# EAGLE design Shruti-Main-v02 (EAGLE 5.06)
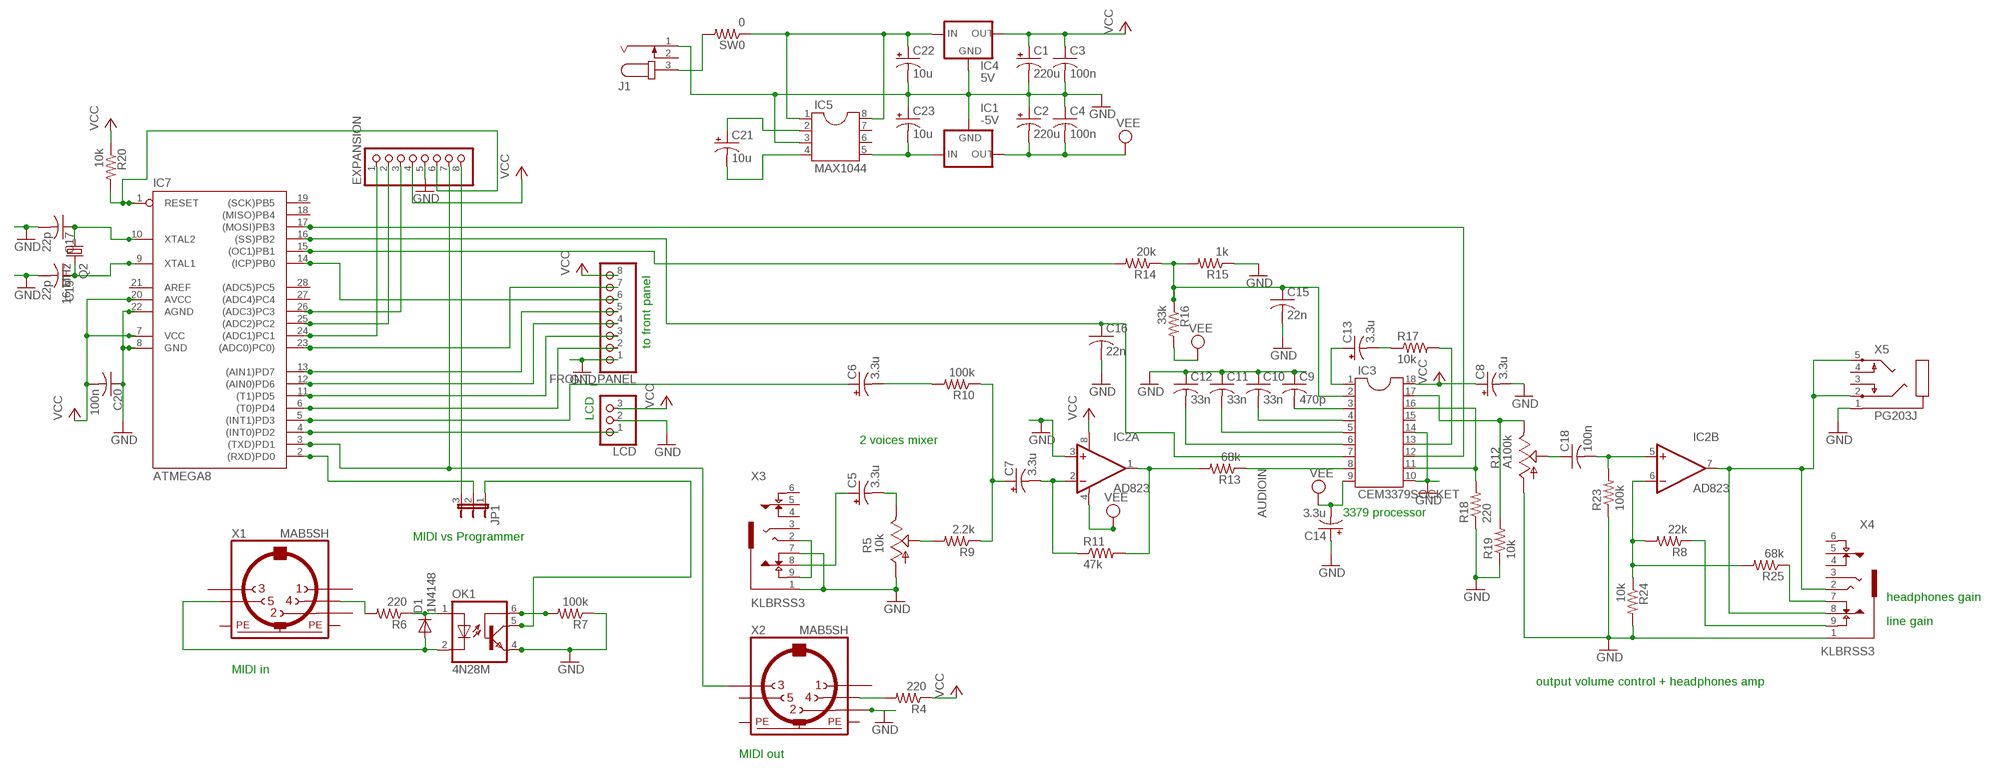
[diagram p0: schematic, sheet 1]

## Parts
C1  220u  CPOL-USE5-8.5  [E5-8,5]
C2  220u  CPOL-USE5-8.5  [E5-8,5]
C3  100n  C-US050-024X044  [C050-024X044]
C4  100n  C-US050-024X044  [C050-024X044]
C5  3.3u  CPOL-USE2.5-6  [E2,5-6]
C6  3.3u  CPOL-USE2.5-6  [E2,5-6]
C7  3.3u  CPOL-USE2.5-6  [E2,5-6]
C8  3.3u  CPOL-USE2.5-6  [E2,5-6]
C9  470p  C-US050-024X044  [C050-024X044]
C10  33n  C-US050-025X075  [C050-025X075]
C11  33n  C-US050-025X075  [C050-025X075]
C12  33n  C-US050-025X075  [C050-025X075]
C13  3.3u  CPOL-USE2.5-6  [E2,5-6]
C14  3.3u  CPOL-USE2.5-6  [E2,5-6]
C15  22n  C-US050-025X075  [C050-025X075]
C16  22n  C-US050-025X075  [C050-025X075]
C17  22p  C-US050-024X044  [C050-024X044]
C18  100n  C-US050-024X044  [C050-024X044]
C19  22p  C-US050-024X044  [C050-024X044]
C20  100n  C-US050-024X044  [C050-024X044]
C21  10u  CPOL-USE2.5-6  [E2,5-6]
C22  10u  CPOL-USE2.5-6  [E2,5-6]
C23  10u  CPOL-USE2.5-6  [E2,5-6]
D1  1N4148  1N4148DO35-7  [DO35-7]
EXPANSION  PINHD-1X8  [1X08]
FRONT_PANEL  PINHD-1X8  [1X08]
IC1  -5V  79XXL  [79XXL]
IC2  AD823  OPA2132P  [DIL08]
IC3  CEM3379SOCKET  [SOCKET18]
IC4  5V  78XXL  [78XXL]
IC5  MAX1044  DIL8  [DIL08]
IC7  ATMEGA8  AT90S4433P  [DIL28-3]
J1  JACK-PLUG1  [SPC4078]
JP1  JP2E  [JP2]
LCD  PINHD-1X3  [1X03]
OK1  4N28M  [DIL06]
Q2  16 MHz  CRYSTALHC49U-V  [HC49U-V]
R4  220  R-US_0204/7  [0204/7]
R5  10k  POT_USCABLED  [CABLE_POT_6MM]
R6  220  R-US_0204/7  [0204/7]
R7  100k  R-US_0204/7  [0204/7]
R8  22k  R-US_0204/7  [0204/7]
R9  2.2k  R-US_0204/7  [0204/7]
R10  100k  R-US_0204/7  [0204/7]
R11  47k  R-US_0204/7  [0204/7]
R12  A100k  POT_USCABLED  [CABLE_POT_6MM]
R13  68k  R-US_0204/7  [0204/7]
R14  20k  R-US_0204/7  [0204/7]
R15  1k  R-US_0204/7  [0204/7]
R16  33k  R-US_0204/7  [0204/7]
R17  10k  R-US_0204/7  [0204/7]
R18  220  R-US_0204/7  [0204/7]
R19  10k  R-US_0204/7  [0204/7]
R20  10k  R-US_0204/7  [0204/7]
R23  100k  R-US_0204/7  [0204/7]
R24  10k  R-US_0204/7  [0204/7]
R25  68k  R-US_0204/7  [0204/7]
SW0  0  R-US_0204/2V  [0204V]
X1  MAB5SH  [MAB5SH]
X2  MAB5SH  [MAB5SH]
X3  KLBRSS3  [KLBRSS3]
X4  KLBRSS3  [KLBRSS3]
X5  PG203J  [PG203J]

## Nets
AUDIOIN: IC2.1(A:OUT) R11.2 R13.2
GND: C1.- C2.+ C3.2 C4.1 C8.- C9.1 C10.1 C11.1 C12.1 C14.+ C15.2 C16.2 C17.2 C19.2 C20.1 C22.- C23.+ EXPANSION.5 FRONT_PANEL.1 IC1.GND IC2.3(A:+IN) IC3.10(GND) IC3.14(PANCV) IC4.GND IC5.3 IC7.8(GND) IC7.22(AGND) J1.1 LCD.2 OK1.4(EMI) R5.A R7.1 R12.A R15.1 R18.1 R19.1 R23.1 R24.2 X2.2 X3.1 X3.7 X4.1 X5.1
N$1: EXPANSION.8 JP1.3
N$2: C22.+ IC4.IN IC5.1 IC5.8 SW0.1
N$3: C21.+ IC5.2
N$4: FRONT_PANEL.2 IC7.6((T0)PD4)
N$5: IC3.8(VCFIN) R13.1
N$6: R4.2 X2.4
N$7: EXPANSION.2 IC7.25((ADC2)PC2)
N$8: FRONT_PANEL.7 IC7.23((ADC0)PC0))
N$9: FRONT_PANEL.4 IC7.12((AIN0)PD6)
N$10: FRONT_PANEL.5 IC7.13((AIN1)PD7)
N$11: IC7.4((INT0)PD2) LCD.1
N$12: C6.- R10.2
N$13: EXPANSION.7 IC7.3((TXD)PD1) X2.3
N$14: D1.C OK1.1(A) R6.1
N$15: C17.1 IC7.10(XTAL2) Q2.1
N$16: D1.A OK1.2(C) X1.5
N$17: R6.2 X1.4
N$18: JP1.1 OK1.5(COL)
N$19: R5.S R9.2
N$20: C6.+ IC7.5((INT1)PD3)
N$21: C7.- IC2.2(A:-IN) R11.1
N$22: FRONT_PANEL.3 IC7.11((T1)PD5)
N$23: C7.+ R9.1 R10.1
N$24: IC2.7(B:OUT) X4.2 X4.8 X5.2 X5.5
N$25: C18.2 IC2.5(B:+IN) R23.2
N$26: C9.2 IC3.3(CD)
N$27: C10.2 IC3.4(CC)
N$28: C5.- R5.E
N$29: C11.2 IC3.5(CB)
N$30: IC3.17(CHB) R12.E R19.2
N$31: C12.2 IC3.6(CA)
N$32: IC7.15((OC1)PB1) R14.2
N$33: C16.1 IC3.7(RESONANCECV) IC7.16((SS)PB2)
N$34: IC3.12(GAINCV) IC7.17((MOSI)PB3)
N$35: IC3.13(VCAIN) R17.2
N$36: C13.- R17.1
N$37: R25.1 X4.7
N$38: IC3.11(VCAOUT) IC3.16(PANIN) R18.2
N$39: C13.+ IC3.1(VCFOUT)
N$40: R8.1 X4.9
N$41: C5.+ X3.8
N$42: EXPANSION.6 IC7.1(RESET) R20.2
N$43: C15.1 IC3.2(FREQUENCYCV) R14.1 R15.2 R16.1
N$44: C18.1 R12.S
N$45: IC2.6(B:-IN) R8.2 R24.1 R25.2
N$46: X3.2 X3.9
N$47: J1.3 SW0.2
N$48: C19.1 IC7.9(XTAL1) Q2.2
N$49: EXPANSION.3 IC7.26((ADC3)PC3)
N$50: FRONT_PANEL.6 IC7.14((ICP)PB0)
N$51: OK1.6(BAS) R7.2
N$52: EXPANSION.1 IC7.24((ADC1)PC1)
N$53: IC7.2((RXD)PD0) JP1.2
N$55: C21.- IC5.4
N$56: C23.- IC1.IN IC5.5
VCC: C1.+ C3.1 C8.+ C20.2 EXPANSION.4 FRONT_PANEL.8 IC2.8(A:V+) IC3.18(VCC) IC4.OUT IC7.7(VCC) IC7.20(AVCC) LCD.3 R4.1 R20.1
VEE: C2.- C4.2 C14.- IC1.OUT IC2.4(A:V-) IC3.9(VEE) R16.2
Unconnected: IC3.15(CHAOUT) IC5.6 IC5.7 IC7.18((MISO)PB4) IC7.19((SCK)PB5) IC7.21(AREF) IC7.27((ADC4)PC4) IC7.28((ADC5)PC5) J1.2 X1.1 X1.2 X1.3 X2.1 X2.5 X3.3 X3.4 X3.5 X3.6 X4.3 X4.4 X4.5 X4.6 X5.3 X5.4

## Notes on the sheet
- to front panel
- LCD
- 2 voices mixer
- 3379 processor
- MIDI vs Programmer
- headphones gain
- line gain
- MIDI in
- output volume control + headphones amp
- MIDI out

## Power pins joined to a net without a drawn wire
PE: X1.PE X1.PE@(PE) X2.PE X2.PE@(PE)

## Library data of the parts
C1 C2 C5-C8 C13 C14 C21-C23 = rcl:CPOL-US: POLARIZED CAPACITOR, American symbol
C3 C4 C9-C12 C15-C20 = rcl:C-US: CAPACITOR, American symbol
D1 = diode:1N4148: DIODE high speed (Philips)
EXPANSION FRONT_PANEL = pinhead:PINHD-1X8: PIN HEADER
IC1 = v-reg:79XXL: VOLTAGE REGULATOR
IC2 = burr-brown:OPA2132: High Speed FET-Input Operational Amplifiers< Product Folder:OPA2132
IC3 = cem:CEM3379: Voltage Controlled Signal Processor VCF+VCA+panner
IC4 = v-reg:78XXL: VOLTAGE REGULATOR
IC5 = ic-package:DIL8: Dual In Line / Socket
IC7 = atmel:AT90S4433: MICROCONTROLLER 4 Kbytes FLASH 128 bytes SRAM 256 bytes EEPROM UART 6-channel 10 bit ADC
J1 = con-jack:JACK-PLUG: DC POWER JACK Power Jack, DC, Right Angle, Through Hole, Rated 5A at 16VDC, PC Terminals Distributor: Farnell (www.Farnell.de) Drawing: 84N1161.pdf / 84N1162.pdf Manufacturer: SPC Technology (www.spctechnology.com) Type: SPC4077 / SPC 4078
JP1 = jumper:JP2E: JUMPER
LCD = pinhead:PINHD-1X3: PIN HEADER
OK1 = optocoupler:4N*?M: General Purpose 6-Pin Phototransistor Optocouplers Source: http://www.fairchildsemi.com/ds/4N/4N35-M.pdf
Q2 = crystal:CRYSTAL: CRYSTAL
R4 R6-R11 R13-R20 R23-R25 SW0 = resistor:R-US_: RESISTOR, American symbol
R5 R12 = pot-cable:POT_US
X1 X2 = con-hirschmann:MAB5SH: Female CONNECTOR 5 pins 90 deg. with shield, horizontal (DIN 41524)
X3 X4 = con-lumberg:KLBRSS3: Jack connectors according to JISC 6560, 6.35 mm Klinkeneinbaukupplung nach JISC 6560, 6,35 mm, 3-polig/stereo, abgewinkelte Ausführung, mit 2 Umschaltern, Leiterplatten Rückseitenmontage Source: http://www.lumberg.de/Produkte/PDFs/KLBRSS3.pdf
X5 = con-hirschmann:PG203J: MIC/HEADPHONE JACK KS-S stereo microphone/headphone jack PG203JN (Schukat)

## Board
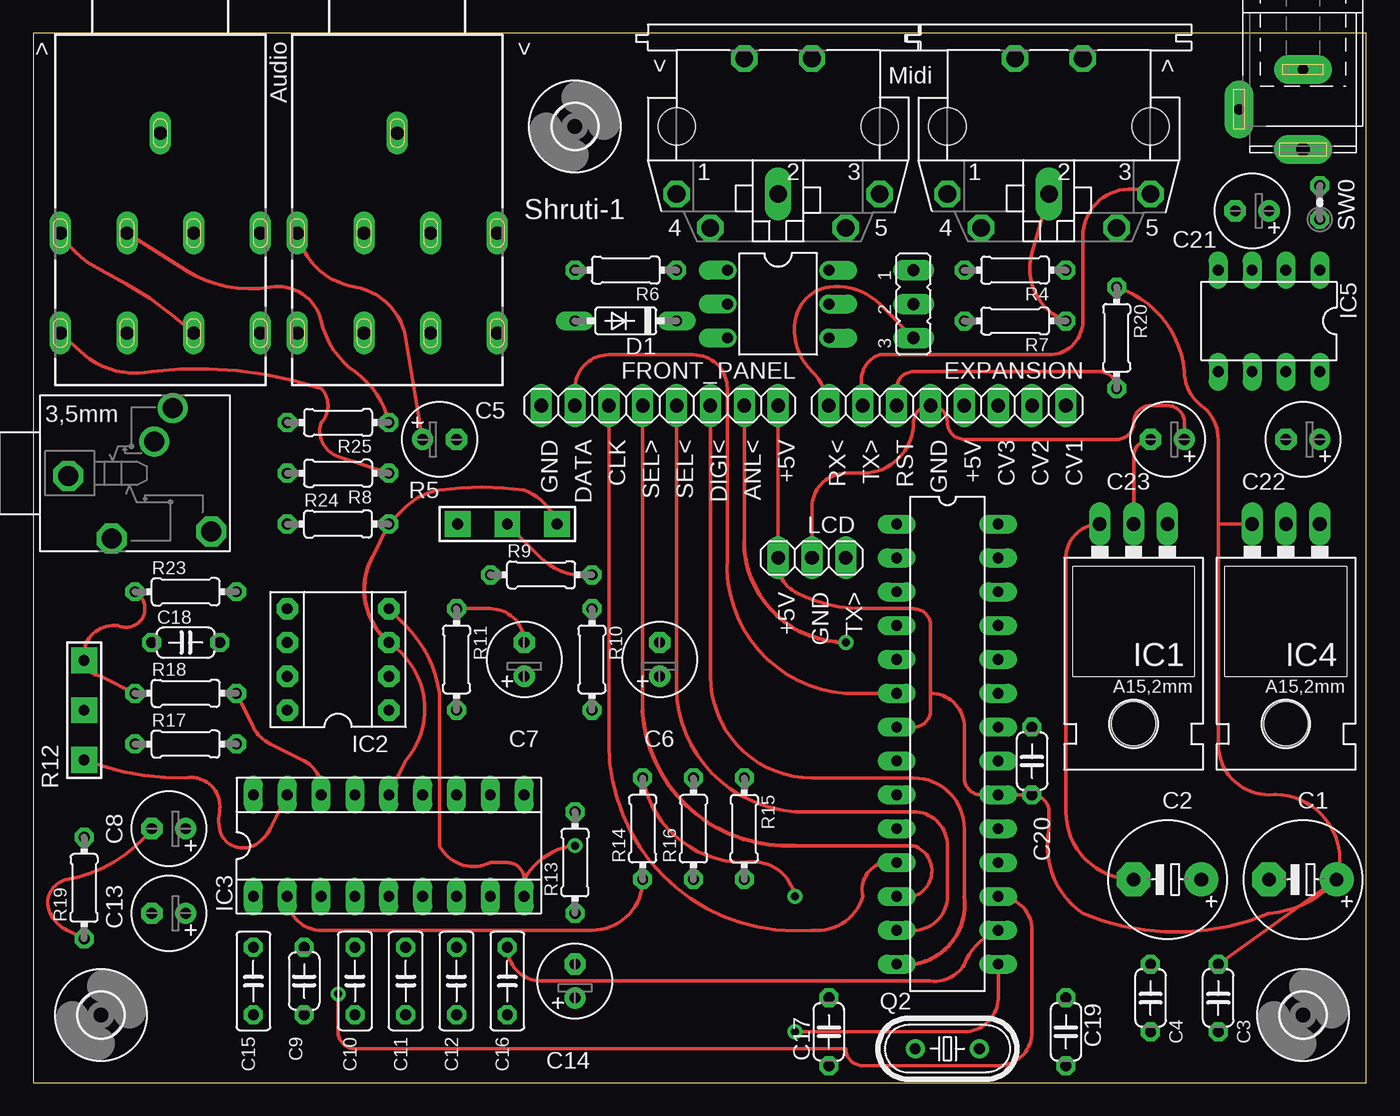
[diagram p1: board, top side]
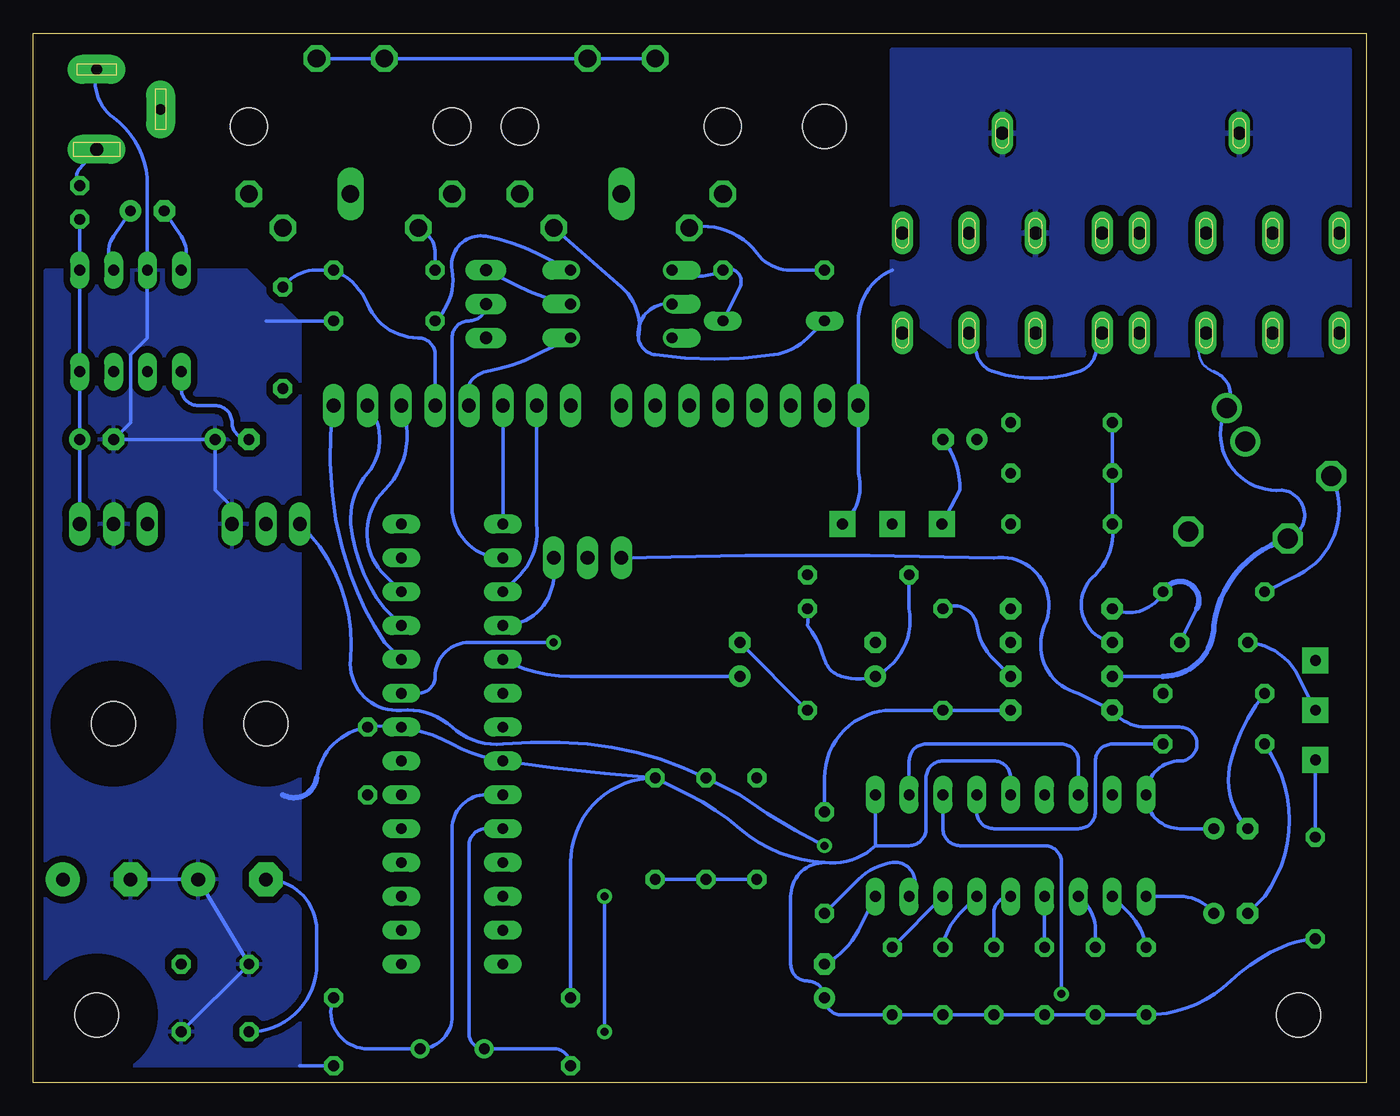
[diagram p2: board, bottom side, seen from below]

Size 100 x 78.73 mm. Coordinates in mm from the lower left corner, seen from the top.
Outline: 100,0 100,78.73 0,78.73 0,0 100,0
Copper layers (1*16): Top 0.035mm / dielectric 1.5mm / Bottom 0.035mm
Design rules "SparkFun": minimum track width 8mil, minimum drill 20mil, track to track 8mil, track to pad 8mil, pad to pad 8mil, via to via 8mil, smd to smd 8mil, copper to edge 10mil, drill to drill 8mil, minimum pad ring 12mil, minimum via ring 10mil, stop-mask expansion 4mil, vias tented up to drill 25mil, thermal gap 10mil

### Footprints (pad centres in the part's own frame; a part is rotated, then mirrored left to right if it is on the bottom)
E5-8,5 = drill 1.016 pad 2.54 round: + -2.54,0 | drill 1.016 pad 2.54 octagon: - 2.54,0
C050-024X044 = drill 0.813 octagon: 1 -2.54,0; 2 2.54,0
E2,5-6 = drill 0.813 pad 1.6 round: + -1.27,0 | drill 0.813 pad 1.6 octagon: - 1.27,0
C050-025X075 = drill 0.813 octagon: 1 -2.54,0; 2 2.54,0
DO35-7 = drill 0.813 long: A 3.81,0; C -3.81,0
1X08 = drill 1.016 long: 1 -8.89,0; 2 -6.35,0; 3 -3.81,0; 4 -1.27,0; 5 1.27,0; 6 3.81,0; 7 6.35,0; 8 8.89,0
79XXL = drill 1.016 long: GND -2.54,-3.81; IN 0,-3.81; OUT 2.54,-3.81 | hole 3.302: 0,11.176
DIL08 = drill 0.813 pad 1.6 octagon: 1 -3.81,-3.81; 2 -1.27,-3.81; 3 1.27,-3.81; 4 3.81,-3.81; 5 3.81,3.81; 6 1.27,3.81; 7 -1.27,3.81; 8 -3.81,3.81
SOCKET18 = drill 0.813 long: 1 -10.16,-3.81; 2 -7.62,-3.81; 3 -5.08,-3.81; 4 -2.54,-3.81; 5 0,-3.81; 6 2.54,-3.81; 7 5.08,-3.81; 8 7.62,-3.81; 9 10.16,-3.81; 10 10.16,3.81; 11 7.62,3.81; 12 5.08,3.81; 13 2.54,3.81; 14 0,3.81; 15 -2.54,3.81; 16 -5.08,3.81; 17 -7.62,3.81; 18 -10.16,3.81
78XXL = drill 1.016 long: GND 0,-3.81; IN -2.54,-3.81; OUT 2.54,-3.81 | hole 3.302: 0,11.176
DIL08' = drill 0.813 long: 1 -3.81,-3.81; 2 -1.27,-3.81; 3 1.27,-3.81; 4 3.81,-3.81; 5 3.81,3.81; 6 1.27,3.81; 7 -1.27,3.81; 8 -3.81,3.81
DIL28-3 = drill 0.813 long: 1 -16.51,-3.81; 2 -13.97,-3.81; 3 -11.43,-3.81; 4 -8.89,-3.81; 5 -6.35,-3.81; 6 -3.81,-3.81; 7 -1.27,-3.81; 8 1.27,-3.81; 9 3.81,-3.81; 10 6.35,-3.81; 11 8.89,-3.81; 12 11.43,-3.81; 13 13.97,-3.81; 14 16.51,-3.81; 15 16.51,3.81; 16 13.97,3.81; 17 11.43,3.81; 18 8.89,3.81; 19 6.35,3.81; 20 3.81,3.81; 21 1.27,3.81; 22 -1.27,3.81; 23 -3.81,3.81; 24 -6.35,3.81; 25 -8.89,3.81; 26 -11.43,3.81; 27 -13.97,3.81; 28 -16.51,3.81
SPC4078 = drill 0.8 pad 2.184 long: 1 -3,0; 2 0,-4.8 | drill 1 pad 2.184 long: 3 3,0
JP2 = drill 0.914 long: 1 -2.54,0; 2 0,0; 3 2.54,0
1X03 = drill 1.016 long: 1 -2.54,0; 2 0,0; 3 2.54,0
DIL06 = drill 0.813 offset: 1 -2.54,-3.81; 2 0,-3.81; 3 2.54,-3.81; 4 2.54,3.81; 5 0,3.81; 6 -2.54,3.81
HC49U-V = drill 0.813 round: 1 -2.413,0; 2 2.413,0
0204/7 = drill 0.813 octagon: 1 -3.81,0; 2 3.81,0
CABLE_POT_6MM = drill 0.8 pad 1.93 square: A -3.73,0; E 3.73,0; S 0,0
0204V = drill 0.813 octagon: 1 -1.27,0; 2 1.27,0
3,3 = hole 3.3: 0,0
MAB5SH = drill 1.321 octagon: 1 7.62,5.08; 3 -7.62,5.08; 4 5.08,7.62; 5 -5.08,7.62; PE -2.54,-5.08; PE@ 2.54,-5.08 | drill 1.321 long: 2 0,5.08 | hole 2.794: 7.62,0; -7.62,0
KLBRSS3 = drill 1 pad 1.6 long: 1 0,-7.5; 2 2.5,-22.5; 3 -2.5,-22.5; 4 2.5,-15; 5 7.5,-15; 6 7.5,-22.5; 7 -2.5,-15; 8 -7.5,-15; 9 -7.5,-22.5
PG203J = drill 1.499 octagon: 1 -5.004,-0.203; 4 5.74,-4.369; 5 -1.753,-4.902 | drill 1.499 round: 2 2.845,4.902; 3 1.448,2.388

### Placement (x,y rotation side)
C1  95.25,15.24 180 top
C2  85.09,15.24 180 top
C3  88.9,6.35 270 top
C4  83.82,6.35 270 top
C5  30.48,48.26 0 top
C6  46.99,31.75 90 top
C7  36.83,31.75 90 top
C8  10.16,19.05 180 top
C9  20.32,7.62 90 top
C10  24.13,7.62 90 top
C11  27.94,7.62 90 top
C12  31.75,7.62 90 top
C13  10.16,12.7 180 top
C14  40.64,7.62 90 top
C15  16.51,7.62 270 top
C16  35.56,7.62 270 top
C17  59.69,3.81 90 top
C18  11.43,33.02 0 top
C19  77.47,3.81 270 top
C20  74.93,24.13 270 top
C21  91.44,65.41 180 top
C22  95.25,48.26 180 top
C23  85.09,48.26 180 top
D1  44.45,57.15 180 top
EXPANSION  68.58,50.8 180 top
FRONT_PANEL  46.99,50.8 0 top
IC1  82.55,38.1 180 top
IC2  22.86,31.75 90 top
IC3  26.67,17.78 0 top
IC4  93.98,38.1 180 top
IC5  MAX1044  [DIL08']  92.71,57.15 180 top
IC7  68.58,25.4 270 top
J1  95.25,73.03 270 top
JP1  66.04,58.42 270 top
LCD  58.42,39.37 180 top
OK1  55.88,58.42 270 top
Q2  68.58,2.54 0 top
R4  73.66,60.96 180 top
R5  35.56,41.91 180 top
R6  44.45,60.96 180 top
R7  73.66,57.15 180 top
R8  22.86,45.72 180 top
R9  38.1,38.1 0 top
R10  41.91,31.75 270 top
R11  31.75,31.75 270 top
R12  3.81,27.94 270 top
R13  40.64,16.51 90 top
R14  45.72,19.05 90 top
R15  53.34,19.05 270 top
R16  49.53,19.05 90 top
R17  11.43,25.4 0 top
R18  11.43,29.21 0 top
R19  3.81,14.61 90 top
R20  81.28,55.88 270 top
R23  11.43,36.83 0 top
R24  22.86,41.91 0 top
R25  22.86,49.53 180 top
SW0  96.52,66.04 90 top
U$1  [3,3]  95.25,5.08 0 top
U$3  [3,3]  5.08,5.08 0 top
U$4  [3,3]  40.64,71.75 0 top
X1  55.88,71.75 180 top
X2  76.2,71.75 180 top
X3  27.3,78.74 0 top
X4  9.53,78.74 0 top
X5  7.62,45.72 0 top

### Tracks (layer width: path | path; a pad name or v marks a point on that pad's centre or on a via)
AUDIOIN
  Bottom 0.254: IC2.1 R11.2 35.56,27.94 arc-90 40.64,22.86 R13.2
GND
  Top 0.254: R18.1 5.08,30.48 arc-72 R12.A arc-106 6.35,34.29 arc177 R23.1 | 25.4,39.37 R24.2 27.94,43.18 arc-37 30.48,44.45 arc-16 36.83,44.45 arc-52 R5.A | X2.2 74.93,62.23 arc85 R7.1 | R19.1 2.54,11.43 arc-37 1.27,12.7 arc-106 2.54,15.24 arc41 C8.- | IC3.14 27.94,24.13 arc97 IC2.3 | LCD.2 58.42,43.18 arc-90 60.96,45.72 62.23,45.72 arc90 66.04,49.53 arc-90 EXPANSION.5 arc-90 68.58,49.53 arc90 69.85,48.26 81.28,48.26 arc90 82.55,49.53 arc-90 83.82,50.8 85.09,50.8 arc-90 86.36,49.53 C23.+
  Top 0.305: IC2.3 arc-76 25.4,39.37
  Bottom 0.203: C9.1 C10.1 C11.1 C12.1 C16.2
  Bottom 0.254: IC1.GND 85.09,43.18 86.36,44.45 C23.+ C22.- 92.71,49.53 92.71,54.61 91.44,55.88 IC5.3 91.44,67.31 arc-53 93.98,72.39 arc68 J1.1 | C1.- C2.+ C4.1 C3.2 | C8.- arc58 10.16,24.13 arc24 R18.1 | C19.2 80.01,1.27 | 35.56,60.96 arc-67 38.1,57.15 FRONT_PANEL.1 38.1,45.72 arc66 R5.A | R7.1 82.55,57.15 | OK1.4 62.23,54.61 arc16 66.04,53.34 arc-106 EXPANSION.5 | 40.64,16.51 arc-90 43.18,13.97 43.18,8.89 arc-90 41.91,7.62 arc90 C14.+ arc-90 39.37,5.08 C16.2 C12.1 C11.1 C10.1 C9.1 C15.2 arc-44 10.16,7.62 arc20 6.35,10.16 arc19 R19.1 | 40.64,16.51 arc-53 36.83,17.78 | R15.1 arc4 IC7.8 arc21 68.58,25.4 arc-21 IC7.22 arc-16 C20.1 arc-37 77.47,25.4 arc-37 78.74,22.86 | R23.1 5.08,38.1 arc-90 X5.1 | 36.83,17.78 34.29,17.78 arc-90 33.02,19.05 33.02,22.86 arc90 31.75,24.13 27.94,24.13 arc90 26.67,22.86 IC3.14 | C17.2 59.69,16.51 arc90 R15.1 | 36.83,17.78 IC3.10 | R15.1 50.8,21.59 arc14 46.99,19.05 arc-38 40.64,16.51
  Bottom 0.406: 78.74,22.86 arc111 81.28,21.59
  pour Bottom (isolate 0.508): 1.27,77.47 1.27,54.61 30.48,54.61 35.56,58.42 35.56,77.47
  pour Bottom (isolate 0.508): 80.01,1.27 99.06,1.27 99.06,60.96 84.03,60.96 80.01,56.94
N$1
  Top 0.254: JP1.3 63.5,58.42 arc53 59.69,59.69 arc74 57.15,57.15 arc53 58.42,53.34 arc-37 EXPANSION.8
N$2
  Bottom 0.203: C22.+ IC5.8
  Bottom 0.254: SW0.1 IC5.1 IC5.8 C22.+ IC4.IN
N$3
  Bottom 0.254: C21.+ 93.98,63.5 arc-67 IC5.2
N$4
  Top 0.254: IC7.6 60.96,29.21 arc-90 52.07,39.37 52.07,52.07 arc90 49.53,54.61 43.18,54.61 arc90 40.64,52.07 FRONT_PANEL.2
N$5
  Bottom 0.254: R13.1 38.1,15.24 arc37 35.56,16.51 arc143 IC3.8
N$6
  Bottom 0.254: R4.2 69.85,62.23 arc-67 X2.4
N$7
  Bottom 0.254: IC7.25 73.66,35.56 arc31 76.2,41.91 arc43 74.93,45.72 arc-80 EXPANSION.2
N$8  (via drill 0.6)
  Top 0.254: 53.34,40.64 FRONT_PANEL.7
  Top 0.305: v60.96,33.02 arc-90 53.34,40.64
  Bottom 0.254: v60.96,33.02 67.31,33.02 arc-90 69.85,30.48 arc90 71.12,29.21 IC7.23
N$9
  Top 0.254: 45.72,27.94 FRONT_PANEL.4 | 57.15,17.78 66.04,17.78 arc-180 IC7.12
  Top 0.305: 57.15,17.78 arc-90 45.72,27.94
N$10
  Top 0.254: FRONT_PANEL.5 48.26,30.48 arc90 57.15,20.32 66.04,20.32 arc-90 68.58,17.78 68.58,13.97 arc-90 66.04,11.43 IC7.13
N$11
  Bottom 0.254: LCD.1 60.96,38.1 arc90 IC7.4
N$12
  Bottom 0.254: R10.2 C6.-
N$13
  Top 0.254: EXPANSION.7 62.23,52.07 arc-90 63.5,54.61 76.2,54.61 arc90 78.74,57.15 78.74,63.5 arc-116 X2.3
  Bottom 0.254: IC7.3 63.5,38.1 arc-53 62.23,41.91 EXPANSION.7
N$14
  Bottom 0.254: D1.C 46.99,59.69 arc-143 R6.1 arc53 OK1.1
N$15
  Bottom 0.254: IC7.10 66.04,19.05 arc-90 67.31,17.78 67.31,3.68 arc-90 Q2.1 60.96,2.54 arc90 C17.1
N$16
  Bottom 0.254: D1.A 41.91,55.88 arc37 44.45,54.61 arc16 53.34,54.61 arc74 54.61,55.88 | 54.61,55.88 arc106 OK1.2 | X1.5 55.88,59.69 arc61 54.61,55.88
N$17
  Bottom 0.254: R6.2 43.18,60.96 arc53 45.72,62.23 arc-65 X1.4
N$18
  Bottom 0.254: JP1.1 63.5,59.69 arc-16 OK1.5
N$19
  Top 0.254: R5.S 38.1,39.37 arc53 R9.2
N$20
  Bottom 0.254: C6.+ 59.69,30.48 arc28 IC7.5
N$21
  Top 0.254: R11.1 34.29,35.56 arc-90 C7.-
  Bottom 0.254: IC2.2 27.94,31.75 arc37 29.21,34.29 arc-111 R11.1
N$22
  Top 0.254: FRONT_PANEL.3 43.18,25.4 arc95 58.42,11.43 arc80 62.23,13.97 arc-117 IC7.11
N$23
  Bottom 0.254: R9.1 34.29,35.56 arc74 C7.+ arc33 39.37,30.48 arc57 40.64,31.75 arc-21 41.91,34.29 arc-16 R10.1
N$24
  Top 0.254: X4.2 arc16 5.08,60.96 arc-32 X4.8
  Bottom 0.203: 11.43,53.34 arc119 X4.2
  Bottom 0.254: 15.24,30.48 IC2.7 | X5.5 arc-156 6.35,44.45 arc122 X5.2 arc-103 11.43,53.34
  Bottom 0.406: 15.24,30.48 arc-90 11.43,34.29 arc67 X5.5
N$25
  Bottom 0.254: C18.2 12.7,35.56 | R23.2 arc90 IC2.5
  Bottom 0.406: 12.7,35.56 arc-180 R23.2
N$26
  Bottom 0.254: C9.2 20.32,11.43 arc-53 IC3.3
N$27
  Bottom 0.254: C10.2 IC3.4
N$28
  Bottom 0.254: R5.E 30.48,44.45 arc-40 C5.-
N$29
  Bottom 0.254: C11.2 27.94,12.7 arc90 IC3.5
N$30
  Top 0.254: IC3.17 17.78,19.05 arc-37 16.51,17.78 arc-106 13.97,19.05 arc-21 13.97,20.32 arc111 11.43,22.86 arc-22 R12.E
  Bottom 0.254: R19.2 R12.E
N$31
  Bottom 0.254: IC3.6 30.48,12.7 arc-37 C12.2
N$32  (via drill 0.6)
  Top 0.254: IC7.15 72.39,6.35 arc-90 69.85,3.81 v57.15,3.81 | v57.15,13.97 arc90 53.34,16.51 arc-80 R14.2
  Bottom 0.254: v57.15,3.81 v57.15,13.97
N$33
  Top 0.254: C16.1 arc90 38.1,7.62 67.31,7.62 arc67 69.85,8.89 arc-45 IC7.16
  Bottom 0.254: IC3.7 C16.1
N$34  (via drill 0.6)
  Top 0.254: IC7.17 arc-90 74.93,11.43 74.93,3.81 arc-90 72.39,1.27 62.23,1.27 arc-90 60.96,2.54 24.13,2.54 arc-90 22.86,3.81 v22.86,6.65
  Bottom 0.254: v22.86,6.65 22.86,16.51 arc-90 24.13,17.78 30.48,17.78 arc90 31.75,19.05 IC3.12
N$35
  Bottom 0.254: IC3.13 29.21,20.32 arc-90 27.94,19.05 21.59,19.05 arc-90 20.32,20.32 20.32,24.13 arc90 19.05,25.4 R17.2
N$36
  Bottom 0.254: C13.- 7.62,13.97 arc-72 R17.1
N$37
  Top 0.254: X4.7 11.43,60.96 arc42 17.78,59.69 arc-87 21.59,57.15 arc41 24.13,53.34 arc-41 R25.1
N$38
  Top 0.254: R18.2 16.51,26.67 arc37 17.78,25.4 20.32,24.13 arc-74 IC3.16
  Bottom 0.254: IC3.11 34.29,24.13 arc90 33.02,25.4 22.86,25.4 arc90 21.59,24.13 IC3.16
N$39
  Bottom 0.254: IC3.1 13.97,13.97 arc53 C13.+
N$40
  Top 0.254: R8.1 22.86,46.99 arc-90 21.59,49.53 arc90 21.59,52.07 arc25 8.89,53.34 arc-51 3.81,54.61 arc3 X4.9
N$41
  Top 0.254: C5.+ 27.94,55.88 arc71 24.13,59.69 arc-67 X3.8
N$42
  Top 0.254: EXPANSION.6 64.77,52.07 arc-90 66.04,53.34 80.01,53.34 arc-90 R20.2
  Bottom 0.254: IC7.1 EXPANSION.6
N$43
  Top 0.254: IC3.2 arc90 21.59,11.43 41.91,11.43 arc90 R14.1
  Bottom 0.203: R16.1 R15.2
  Bottom 0.254: IC3.2 17.78,12.7 arc37 C15.1 | R14.1 R16.1 R15.2
N$44
  Bottom 0.254: R12.S 5.08,30.48 arc-59 C18.1
N$45
  Bottom 0.203: R8.2 R25.2
  Bottom 0.254: IC2.6 arc129 20.32,38.1 arc-53 R24.1 R8.2 R25.2
N$46
  Bottom 0.254: X3.9 20.32,54.61 arc55 21.59,53.34 arc35 27.94,53.34 arc55 29.21,54.61 arc-5 X3.2
N$47
  Bottom 0.254: J1.3 96.52,68.58 arc-83 SW0.2
N$48
  Bottom 0.254: C19.1 arc-113 74.93,2.54 Q2.2 arc-90 68.58,4.95 68.58,19.05 arc90 66.04,21.59 IC7.9
N$49
  Bottom 0.254: IC7.26 73.66,38.1 arc37 74.93,40.64 arc53 73.66,44.45 arc-67 EXPANSION.3
N$50
  Top 0.254: FRONT_PANEL.6 50.8,30.48 arc90 58.42,22.86 66.04,22.86 arc-90 69.85,19.05 69.85,13.97 | IC7.14 66.04,8.89
  Top 0.305: 66.04,8.89 arc90 69.85,13.97
N$51
  Bottom 0.254: OK1.6 62.23,62.23 arc-16 66.04,63.5 arc-111 68.58,60.96 arc57 R7.2
N$52
  Bottom 0.254: IC7.24 73.66,33.02 arc14 76.2,38.1 arc27 EXPANSION.1
N$53
  Bottom 0.254: JP1.2 arc90 67.31,57.15 arc-90 68.58,55.88 68.58,43.18 arc-90 IC7.2
N$55
  Bottom 0.254: C21.- 88.9,63.5 arc67 IC5.4
N$56
  Top 0.254: C23.- arc90 82.55,46.99 IC1.IN
  Bottom 0.254: C23.- arc90 85.09,49.53 arc-90 86.36,50.8 87.63,50.8 arc90 88.9,52.07 IC5.5
PE
  Bottom 0.254: X1.PE@ X1.PE X2.PE@ X2.PE
VCC
  Top 0.254: R20.1 arc-67 86.36,53.34 arc53 87.63,50.8 arc-53 88.9,48.26 88.9,41.91 | FRONT_PANEL.8 LCD.3 arc71 57.15,36.83 arc28 62.23,35.56 66.04,35.56 arc-90 67.31,34.29 67.31,29.21 | 67.31,29.21 67.31,27.94 arc-90 66.04,26.67 IC7.7 | 67.31,29.21 arc-90 69.85,26.67 69.85,22.86 arc90 71.12,21.59 IC7.20 C20.2 arc-90 76.2,20.32 76.2,19.05 arc67 78.74,12.7 arc45 92.71,12.7 arc45 C1.+ | C1.+ arc113 92.71,21.59 arc-90 88.9,25.4 88.9,41.91 | C1.+ C3.1 | 88.9,41.91 IC4.OUT
  Bottom 0.254: C8.+ 13.97,19.05 arc90 IC3.18 arc90 13.97,24.13 arc-180 13.97,26.67 16.51,26.67 arc53 IC2.8 21.59,29.21 arc99 24.13,34.29 arc-124 27.94,39.37 arc-3 LCD.3 | R20.1 arc53 78.74,60.96 R4.1 arc45 74.93,58.42 arc-67 71.12,55.88 arc90 69.85,54.61 EXPANSION.4
VEE  (via drill 0.6)
  Top 0.254: C2.- arc-90 77.47,20.32 77.47,39.37 arc-90 IC1.OUT | IC2.4 27.94,34.29 arc-37 30.48,29.21 30.48,17.78 arc90 34.29,16.51 35.56,16.51 arc-90 36.83,15.24 | IC3.9 36.83,15.24 | 36.83,15.24 arc-56 v40.64,17.78
  Bottom 0.254: C4.2 arc-90 78.74,8.89 78.74,11.43 arc-90 C2.- | IC3.9 38.1,11.43 arc37 C14.- | v40.64,17.78 arc10 46.99,21.59 R16.2 arc-21 58.42,25.4 arc-11 64.77,25.4 arc48 68.58,26.67 arc-48 72.39,27.94 arc101 76.2,31.75 arc-52 IC1.OUT

### Text on the board
tPlace: > | Audio | < | < | > | Midi | Shruti-1 | GND | DATA | CLK | SEL> | SEL< | DIGI< | ANL< | +5V | RX< | TX> | RST | GND | +5V | CV3 | CV2 | CV1 | +5V | GND | TX>
license: ol.gillet@gmail.com | cc-by-nc-sa 3.0